# EAGLE design x2-feed (EAGLE 8.2.0)
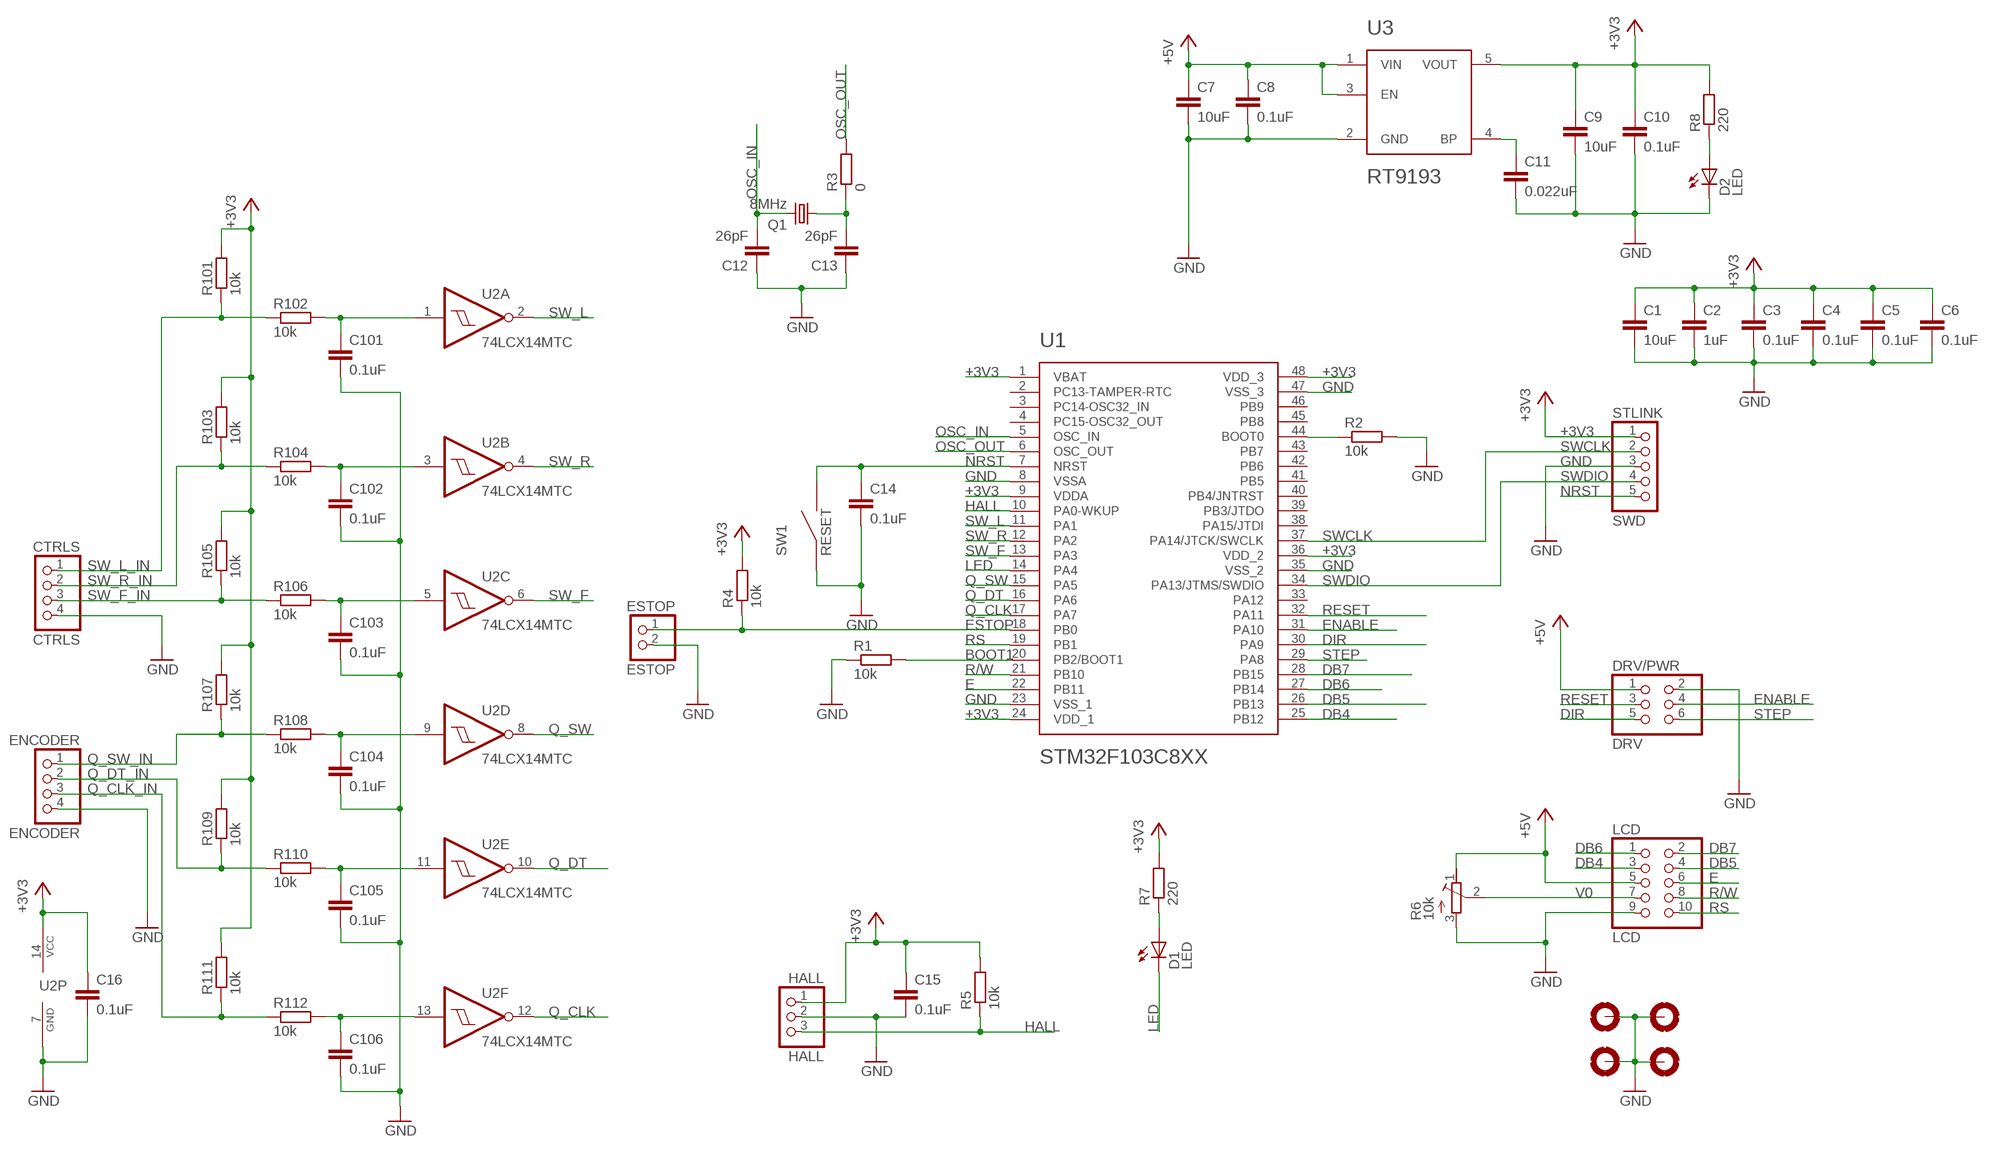
[diagram p0: schematic, sheet 1]

## Parts
C1  10uF  CC2012  [C2012]
C2  1uF  CC1608  [C1608]
C3  0.1uF  CC1608  [C1608]
C4  0.1uF  CC1608  [C1608]
C5  0.1uF  CC1608  [C1608]
C6  0.1uF  CC1608  [C1608]
C7  10uF  CC2012  [C2012]
C8  0.1uF  CC1608  [C1608]
C9  10uF  CC2012  [C2012]
C10  0.1uF  CC1608  [C1608]
C11  0.022uF  CC1608  [C1608]
C12  26pF  CC1608  [C1608]
C13  26pF  CC1608  [C1608]
C14  0.1uF  CC1608  [C1608]
C15  0.1uF  CC1608  [C1608]
C16  0.1uF  CC1608  [C1608]
C101  0.1uF  CC1608  [C1608]
C102  0.1uF  CC1608  [C1608]
C103  0.1uF  CC1608  [C1608]
C104  0.1uF  CC1608  [C1608]
C105  0.1uF  CC1608  [C1608]
C106  0.1uF  CC1608  [C1608]
CTRLS  CTRLS  PINHD-1X4  [1X04]
D1  LED  [LED2012]
D2  LED  [LED2012]
DRV/PWR  DRV  PINHD-2X3  [2X03]
ENCODER  ENCODER  PINHD-1X4  [1X04]
ESTOP  ESTOP  PINHD-1X2  [1X02]
H1  MOUNT-PAD-ROUND2.8  [2,8-PAD]
H2  MOUNT-PAD-ROUND2.8  [2,8-PAD]
H3  MOUNT-PAD-ROUND2.8  [2,8-PAD]
H4  MOUNT-PAD-ROUND2.8  [2,8-PAD]
HALL  HALL  5-103361-1  [5-103361-1]
LCD  LCD  PINHD-2X5  [2X05]
Q1  8MHz  CRYSTAL9B  [HC49/S]
R1  10k  RR1608  [R1608]
R2  10k  RR1608  [R1608]
R3  0  RR1608  [R1608]
R4  10k  RR1608  [R1608]
R5  10k  RR1608  [R1608]
R6  10k  R-TRIMMT93YA  [RTRIMT93YA]
R7  220  RR1608  [R1608]
R8  220  RR1608  [R1608]
R101  10k  RR1608  [R1608]
R102  10k  RR1608  [R1608]
R103  10k  RR1608  [R1608]
R104  10k  RR1608  [R1608]
R105  10k  RR1608  [R1608]
R106  10k  RR1608  [R1608]
R107  10k  RR1608  [R1608]
R108  10k  RR1608  [R1608]
R109  10k  RR1608  [R1608]
R110  10k  RR1608  [R1608]
R111  10k  RR1608  [R1608]
R112  10k  RR1608  [R1608]
STLINK  SWD  PINHD-1X5  [1X05]
SW1  RESET  PUSH  [PUSH]
U1  STM32F103C8XX  [LQFP48-7X7MM]
U2  74LCX14MTC  [TSSOP14]
U3  RT9193  [SOT23-5L]

## Nets
+3V3: C1.1 C2.1 C3.1 C4.1 C5.1 C6.1 C9.1 C10.1 C15.1 C16.1 HALL.1 R4.2 R5.2 R7.2 R8.2 R101.2 R103.2 R105.2 R107.2 R109.2 R111.2 STLINK.1 U1.1(VBAT) U1.9(VDDA) U1.24(VDD_1) U1.36(VDD_2) U1.48(VDD_3) U2.14(P:VCC) U3.5(VOUT)
+5V: C7.1 C8.1 DRV/PWR.1 LCD.5 R6.1(E) U3.1(VIN) U3.3(EN)
BOOT0: R2.1 U1.44(BOOT0)
BOOT1: R1.2 U1.20(PB2/BOOT1)
BP: C11.1 U3.4(BP)
DB4: LCD.3 U1.25(PB12)
DB5: LCD.4 U1.26(PB13)
DB6: LCD.1 U1.27(PB14)
DB7: LCD.2 U1.28(PB15)
DIR: DRV/PWR.5 U1.30(PA9)
E: LCD.6 U1.22(PB11)
ENABLE: DRV/PWR.4 U1.31(PA10)
ESTOP: ESTOP.1 R4.1 U1.18(PB0)
GND: C1.2 C2.2 C3.2 C4.2 C5.2 C6.2 C7.2 C8.2 C9.2 C10.2 C11.2 C12.1 C13.1 C14.2 C15.2 C16.2 C101.2 C102.2 C103.2 C104.2 C105.2 C106.2 CTRLS.4 D2.C DRV/PWR.2 ENCODER.4 ESTOP.2 H1.B2,8(MOUNT) H2.B2,8(MOUNT) H3.B2,8(MOUNT) H4.B2,8(MOUNT) HALL.2 LCD.9 R1.1 R2.2 R6.3(A) STLINK.3 SW1.1 SW1.2 U1.8(VSSA) U1.23(VSS_1) U1.35(VSS_2) U1.47(VSS_3) U2.7(P:GND) U3.2(GND)
HALL: HALL.3 R5.1 U1.10(PA0-WKUP)
LED: D1.C U1.14(PA4)
N$1: C13.2 Q1.1 R3.1
N$2: D1.A R7.1
N$3: C101.1 R102.2 U2.1(A:I)
N$4: D2.A R8.1
N$5: C102.1 R104.2 U2.3(B:I)
N$7: C103.1 R106.2 U2.5(C:I)
N$9: C104.1 R108.2 U2.9(D:I)
N$11: C105.1 R110.2 U2.11(E:I)
N$12: C106.1 R112.2 U2.13(F:I)
NRST: C14.1 STLINK.5 SW1.3 SW1.4 U1.7(NRST)
OSC_IN: C12.2 Q1.2 U1.5(OSC_IN)
OSC_OUT: R3.2 U1.6(OSC_OUT)
Q_CLK: U1.17(PA7) U2.12(F:O)
Q_CLK_IN: ENCODER.3 R111.1 R112.1
Q_DT: U1.16(PA6) U2.10(E:O)
Q_DT_IN: ENCODER.2 R109.1 R110.1
Q_SW: U1.15(PA5) U2.8(D:O)
Q_SW_IN: ENCODER.1 R107.1 R108.1
R/W: LCD.8 U1.21(PB10)
RESET: DRV/PWR.3 U1.32(PA11)
RS: LCD.10 U1.19(PB1)
STEP: DRV/PWR.6 U1.29(PA8)
SW_F: U1.13(PA3) U2.6(C:O)
SW_F_IN: CTRLS.3 R105.1 R106.1
SW_L: U1.11(PA1) U2.2(A:O)
SW_L_IN: CTRLS.1 R101.1 R102.1
SW_R: U1.12(PA2) U2.4(B:O)
SW_R_IN: CTRLS.2 R103.1 R104.1
SWCLK: STLINK.2 U1.37(PA14/JTCK/SWCLK)
SWDIO: STLINK.4 U1.34(PA13/JTMS/SWDIO)
V0: LCD.7 R6.2(S)
Unconnected: U1.2(PC13-TAMPER-RTC) U1.3(PC14-OSC32_IN) U1.4(PC15-OSC32_OUT) U1.33(PA12) U1.38(PA15/JTDI) U1.39(PB3/JTDO) U1.40(PB4/JNTRST) U1.41(PB5) U1.42(PB6) U1.43(PB7) U1.45(PB8) U1.46(PB9)

## Library data of the parts
C1-C16 C101-C106 = x2-feed:C
CTRLS ENCODER = x2-feed:PINHD-1X4: PIN HEADER
D1 D2 = x2-feed:LED
DRV/PWR = x2-feed:PINHD-2X3: PIN HEADER
ESTOP = x2-feed:PINHD-1X2: PIN HEADER
H1-H4 = x2-feed:MOUNT-PAD-ROUND: MOUNTING PAD, round
HALL = x2-feed:5-103361-1: PIN HEADER
LCD = x2-feed:PINHD-2X5: PIN HEADER
Q1 = x2-feed:CRYSTAL
R1-R5 R7 R8 R101-R112 = x2-feed:R
R6 = x2-feed:R-TRIMM: Trimm resistor
STLINK = x2-feed:PINHD-1X5: PIN HEADER
SW1 = x2-feed:PUSH
U1 = x2-feed:STM32F103C8XX
U2 = x2-feed:74LCX14MTC
U3 = x2-feed:RT9193

## Board
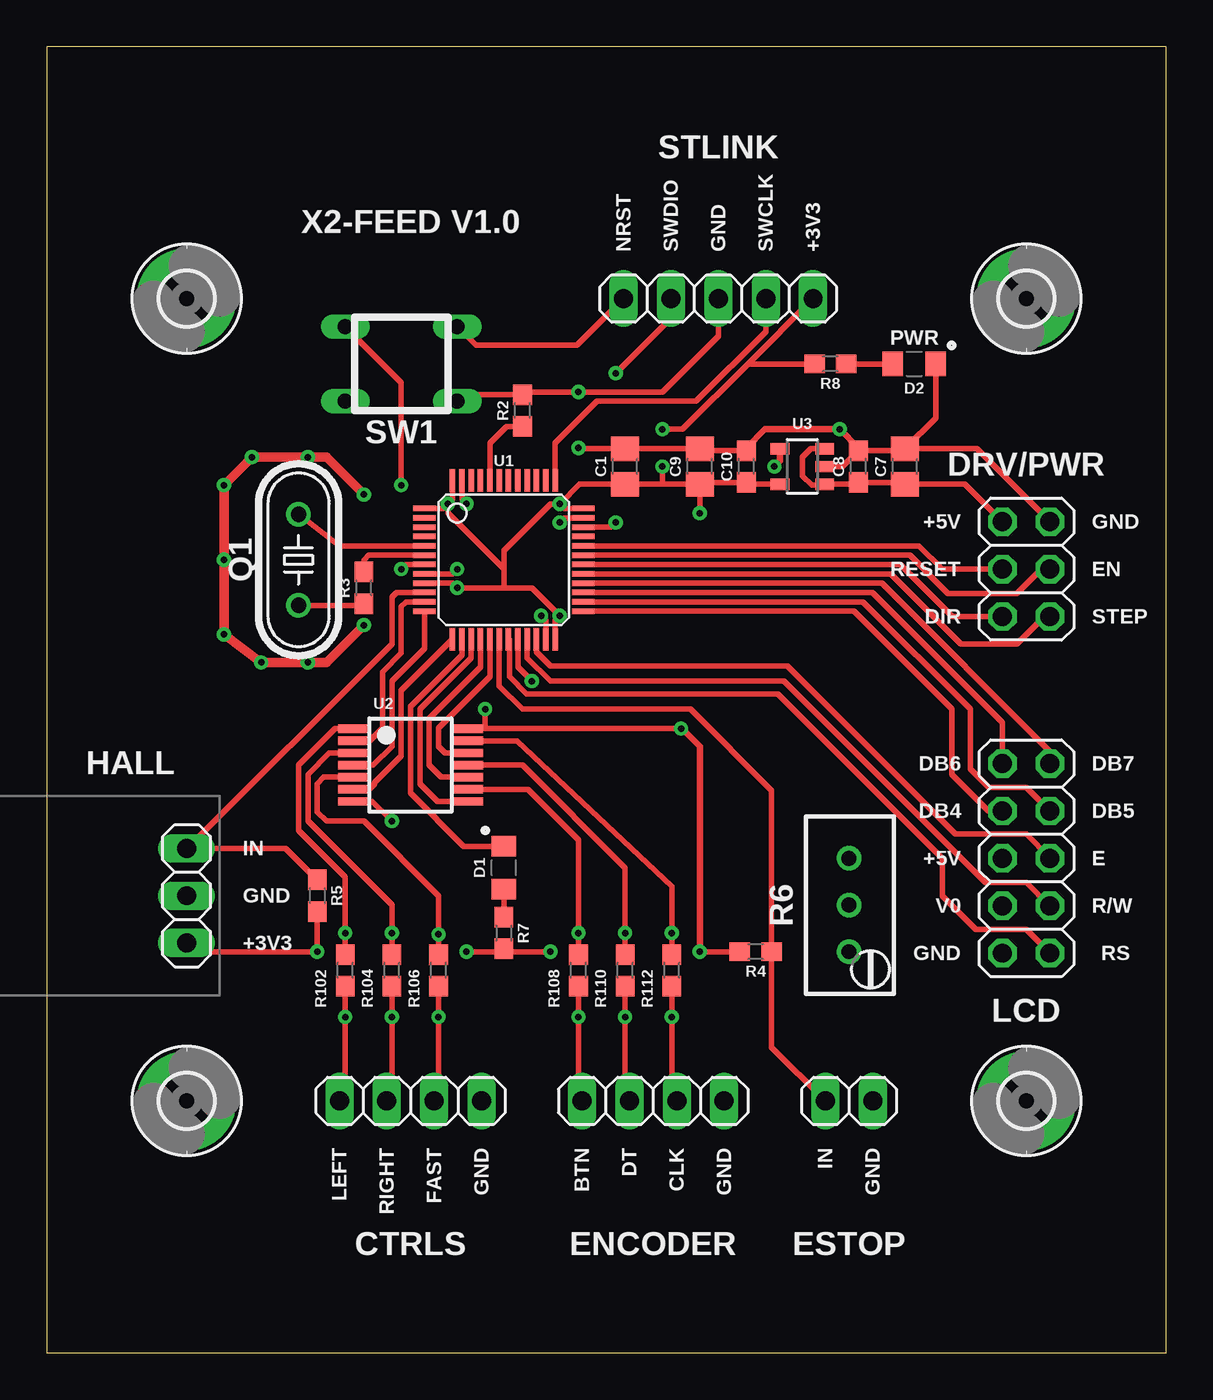
[diagram p1: board, top side]
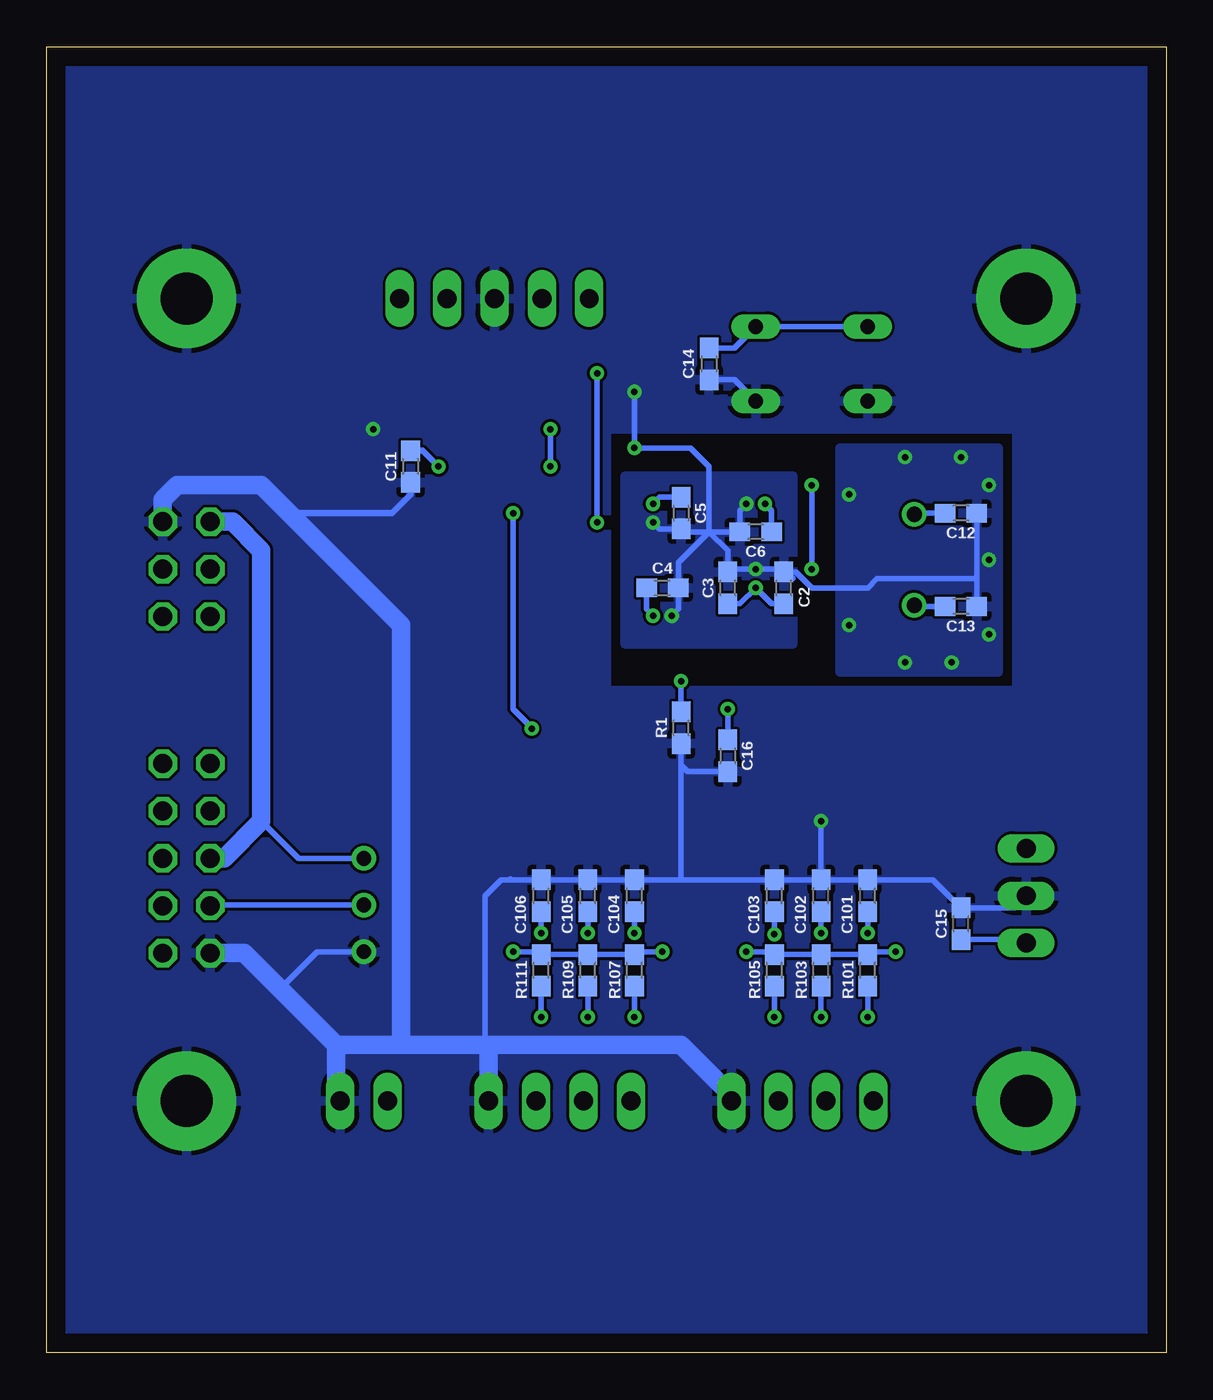
[diagram p2: board, bottom side, seen from below]

Size 60 x 70 mm. Coordinates in mm from the lower left corner, seen from the top.
Outline: 0,0 60,0 60,70 0,70 0,0
Copper layers (1*16): Top 0.035mm / dielectric 1.5mm / Bottom 0.035mm
Design rules "pcbway": minimum track width 0.15mm, minimum drill 0.3mm, track to track 6mil, track to pad 6mil, pad to pad 6mil, via to via 6mil, smd to smd 6mil, copper to edge 40mil, drill to drill 6mil, minimum pad ring 10mil, minimum via ring 8mil, stop-mask expansion 4mil, vias tented up to drill 0mil, thermal gap 10mil

### Footprints (pad centres in the part's own frame; a part is rotated, then mirrored left to right if it is on the bottom)
C2012 = smd 1.3 x 1.5: 1 -0.95,0; 2 0.95,0
C1608 = smd 1.1 x 1: 1 -0.85,0; 2 0.85,0
1X04 = drill 1.016 long: 1 -3.81,0; 2 -1.27,0; 3 1.27,0; 4 3.81,0
LED2012 = smd 1.1 x 1.3: A -1.15,0; C 1.15,0
2X03 = drill 1.016 octagon: 1 -2.54,-1.27; 2 -2.54,1.27; 3 0,-1.27; 4 0,1.27; 5 2.54,-1.27; 6 2.54,1.27
1X02 = drill 1.016 long: 1 -1.27,0; 2 1.27,0
2,8-PAD = drill 2.8 pad 5.334: B2,8 0,0
5-103361-1 = drill 1.016 long: 1 -2.54,0; 2 0,0; 3 2.54,0
2X05 = drill 1.016 octagon: 1 -5.08,-1.27; 2 -5.08,1.27; 3 -2.54,-1.27; 4 -2.54,1.27; 5 0,-1.27; 6 0,1.27; 7 2.54,-1.27; 8 2.54,1.27; 9 5.08,-1.27; 10 5.08,1.27
HC49/S = drill 0.813: 1 -2.44,0; 2 2.44,0
R1608 = smd 1.1 x 1: 1 -0.85,0; 2 0.85,0
RTRIMT93YA = drill 0.8: 1 0,-2.5; 2 0,0; 3 0,2.5
1X05 = drill 1.016 long: 1 -5.08,0; 2 -2.54,0; 3 0,0; 4 2.54,0; 5 5.08,0
PUSH = drill 0.8 long: 1 -3,2; 2 3,2; 3 -3,-2; 4 3,-2
LQFP48-7X7MM = smd 1.2 x 0.3: 1 -4.25,2.75; 2 -4.25,2.25; 3 -4.25,1.75; 4 -4.25,1.25; 5 -4.25,0.75; 6 -4.25,0.25; 7 -4.25,-0.25; 8 -4.25,-0.75; 9 -4.25,-1.25; 10 -4.25,-1.75; 11 -4.25,-2.25; 12 -4.25,-2.75; 25 4.25,-2.75; 26 4.25,-2.25; 27 4.25,-1.75; 28 4.25,-1.25; 29 4.25,-0.75; 30 4.25,-0.25; 31 4.25,0.25; 32 4.25,0.75; 33 4.25,1.25; 34 4.25,1.75; 35 4.25,2.25; 36 4.25,2.75 | smd 0.3 x 1.2: 13 -2.75,-4.25; 14 -2.25,-4.25; 15 -1.75,-4.25; 16 -1.25,-4.25; 17 -0.75,-4.25; 18 -0.25,-4.25; 19 0.25,-4.25; 20 0.75,-4.25; 21 1.25,-4.25; 22 1.75,-4.25; 23 2.25,-4.25; 24 2.75,-4.25; 37 2.75,4.25; 38 2.25,4.25; 39 1.75,4.25; 40 1.25,4.25; 41 0.75,4.25; 42 0.25,4.25; 43 -0.25,4.25; 44 -0.75,4.25; 45 -1.25,4.25; 46 -1.75,4.25; 47 -2.25,4.25; 48 -2.75,4.25
TSSOP14 = smd 0.45 x 1.65: 1 -1.95,-3.05; 2 -1.3,-3.05; 3 -0.65,-3.05; 4 0,-3.05; 5 0.65,-3.05; 6 1.3,-3.05; 7 1.95,-3.05; 8 1.95,3.05; 9 1.3,3.05; 10 0.65,3.05; 11 0,3.05; 12 -0.65,3.05; 13 -1.3,3.05; 14 -1.95,3.05
SOT23-5L = smd 0.6 x 1: 1 -0.95,-1.2; 2 0,-1.2; 3 0.95,-1.2; 4 0.95,1.2; 5 -0.95,1.2

### Placement (x,y rotation side)
C1  31,47.5 90 top
C2  20.5,41 90 bottom
C3  23.5,41 90 bottom
C4  27,41 0 bottom
C5  26,45 270 bottom
C6  22,44 180 bottom
C7  46,47.5 90 top
C8  43.5,47.5 90 top
C9  35,47.5 90 top
C10  37.5,47.5 90 top
C11  40.5,47.5 270 bottom
C12  11,45 180 bottom
C13  11,40 180 bottom
C14  24.5,53 270 bottom
C15  11,23 90 bottom
C16  23.5,32 270 bottom
C101  16,24.5 90 bottom
C102  18.5,24.5 90 bottom
C103  21,24.5 90 bottom
C104  28.5,24.5 90 bottom
C105  31,24.5 90 bottom
C106  33.5,24.5 90 bottom
CTRLS  19.5,13.5 0 top
D1  24.5,26 90 top
D2  46.5,53 0 top
DRV/PWR  52.5,42 270 top
ENCODER  32.5,13.5 0 top
ESTOP  43,13.5 0 top
H1  7.5,13.5 0 top
H2  52.5,13.5 0 top
H3  52.5,56.5 0 top
H4  7.5,56.5 0 top
HALL  7.5,24.5 90 top
LCD  52.5,26.5 270 top
Q1  13.5,42.5 90 top
R1  26,33.5 90 bottom
R2  25.5,50.5 90 top
R3  17,41 90 top
R4  38,21.5 180 top
R5  14.5,24.5 270 top
R6  43,24 180 top
R7  24.5,22.5 270 top
R8  42,53 180 top
R101  16,20.5 90 bottom
R102  16,20.5 90 top
R103  18.5,20.5 90 bottom
R104  18.5,20.5 90 top
R105  21,20.5 90 bottom
R106  21,20.5 90 top
R107  28.5,20.5 90 bottom
R108  28.5,20.5 90 top
R109  31,20.5 90 bottom
R110  31,20.5 90 top
R111  33.5,20.5 90 bottom
R112  33.5,20.5 90 top
STLINK  36,56.5 180 top
SW1  19,53 180 top
U1  24.5,42.5 0 top
U2  19.5,31.5 270 top
U3  40.5,47.5 90 top

### Tracks (layer width: path | path; a pad name or v marks a point on that pad's centre or on a via)
+3V3  (via drill 0.35)
  Top 0.3: U3.5 37.6,46.55 C10.1 35.1,46.65 C9.1 | 34.05,33.45 v34,33.45 23.5,33.45 | 23.5,33.45 U2.14 | U1.36 27.75,45.25 v27.5,45.5 | U1.9 21.75,41.25 v22,41 24.5,41 | U1.48 21.75,45.75 v21.5,45.5 | U1.24 27.25,39.25 v27.5,39.5 26,41 24.5,41 | v21.5,45.5 21.5,45 24.5,42 | v27.5,45.5 27,45.5 24.5,43 24.5,42 | 24.5,42 24.5,41 | v27.5,45.5 28.55,46.55 C1.1 33,46.55 | U1.1 21.25,45.25 v21.5,45.5 | 33,46.55 C9.1 | v33,47.5 33,46.55 | C9.1 v35,45 | v33,49.5 34.08,49.5 37.58,53 | 37.58,53 STLINK.1 | R4.2 v35,21.5 | 23.5,33.45 v23.5,34.5 | HALL.1 7.96,21.5 v14.5,21.5 R5.2 | R8.2 37.58,53 | v22.5,21.5 24.35,21.5 R7.2 24.65,21.5 v27,21.5
  Top 0.35: v35,21.5 35,32.5 34.05,33.45
  Bottom 0.3: 20.25,40.15 C2.1 21.15,40.15 v22,41 22.85,40.15 C3.1 | R111.2 33.5,21.5 | R111.2 R109.2 R107.2 28.35,21.5 v27,21.5 | C4.1 27.85,39.85 v27.5,39.5 | C6.1 21.15,45.15 v21.5,45.5 | C5.1 27.15,45.85 v27.5,45.5 | v35,45 35,34.5 34,33.5 v34,33.45 | C15.1 7.69,22.15 HALL.1 | v33,47.5 v33,49.5 | v22.5,21.5 21.15,21.5 R105.2 R103.2 R101.2 15.85,21.5 v14.5,21.5 | v35,21.5 33.65,21.5 R111.2 | C16.1 v23.5,34.5
+5V
  Top 0.3: U3.3 40.95,48.45 40.5,48 40.5,47 41,46.5 41.65,46.5 U3.1 43.4,46.55 C8.1 45.9,46.65 C7.1 49.22,46.55 DRV/PWR.1
  Bottom 0.3: R6.1 46.5,26.5 48.5,28.5
  Bottom 1: DRV/PWR.1 50.04,44.54 48.5,43 48.5,28.5 50.5,26.5 LCD.5
BOOT0
  Top 0.3: U1.44 23.75,48.75 24.65,49.65 R2.1
BOOT1  (via drill 0.35)
  Top 0.3: U1.20 25.25,36.75 v26,36
  Bottom 0.3: v26,36 R1.2
BP  (via drill 0.35)
  Top 0.35: U3.4 39.3,47.8 v39,47.5
  Bottom 0.35: C11.1 39.85,48.35 v39,47.5
DB4
  Top 0.3: U1.25 43.25,39.75 48.5,34.5 48.5,31 50.46,29.04 LCD.3
DB5
  Top 0.3: LCD.4 52.51,30.3 50.5,30.3 49.5,31.3 49.5,34.5 43.75,40.25 U1.26
DB6
  Top 0.3: U1.27 44.25,40.75 51.23,33.77 LCD.1
DB7
  Top 0.3: LCD.2 53.77,32.23 44.75,41.25 U1.28
DIR
  Top 0.3: U1.30 45.75,42.25 48.54,39.46 DRV/PWR.5
E
  Top 0.3: U1.22 26.25,37.55 27,36.8 39.7,36.8 48.7,27.8 52.5,27.8 53.77,26.53 LCD.6
ENABLE
  Top 0.3: U1.31 46.25,42.75 48.3,40.7 52,40.7 53.3,42 DRV/PWR.4
ESTOP
  Top 0.3: U1.18 24.25,35.75 25.5,34.5 34.5,34.5 38.85,30.15 R4.1 38.85,16.38 ESTOP.1
GND  (via drill 0.35)
  Top 0.3: U3.2 42.65,47.5 C8.2 45.9,48.35 C7.2 | C10.2 35.1,48.35 C9.2 C1.2 28.55,48.45 v28.5,48.5 | C7.2 49.86,48.45 DRV/PWR.2 | U2.7 17.45,29.55 v18.5,28.5 | U1.8 21.75,41.75 v22,42 | U1.47 22.25,45.75 v22.5,45.5 | U1.35 27.75,44.75 v27.5,44.5 | U1.23 26.75,39.25 v26.5,39.5 | STLINK.3 36,54.5 33,51.5 v28.5,51.5 25.65,51.5 R2.2 22.35,51.35 SW1.1 | D2.C 47.65,50.1 C7.2
  Top 0.35: C10.2 37.5,48.5 38.5,49.5 v42.5,49.5 43.5,48.5 C8.2
  Top 0.5: v17,39 15,37 v14,37 v11.5,37 v9.5,38.5 v9.5,42.5 v9.5,46.5 v11,48 v14,48 15,48 v17,46
  Bottom 0.3: C102.2 C101.2 12.5,25.35 C15.2 8.15,23.85 HALL.2 | C102.2 C103.2 26,25.35 | 26,25.35 C104.2 C105.2 C106.2 35.2,25.35 | 35.2,25.35 35.65,25.35 36.5,24.5 36.5,16.5 | C102.2 v18.5,28.5 | 26,31.5 26,25.35 | 26,31.5 R1.1 | C2.2 20.65,42 v22,42 23.35,42 C3.2 23.5,43 24.5,44 | v26.5,39.5 26.15,39.85 C4.2 26.15,42.35 24.5,44 | v22.5,45.5 22.85,45.15 C6.2 24.5,44 | v27.5,44.5 27.15,44.15 C5.2 25.85,44 24.5,44 | 35.15,25.4 35.2,25.35 | 24.5,44 24.5,47.5 25.5,48.5 v28.5,48.5 v28.5,51.5 | C14.2 23.15,52.15 SW1.1 | 10.15,41.5 C13.1 | 10.15,41.5 C12.1 | C2.2 20.35,41.85 20,41.5 | C2.2 19.85,41.85 19,41 16,41 15.5,41.5 10.15,41.5 | C16.2 25.65,31.15 26,31.5 | R6.3 45.5,21.5 47.5,19.5
  Bottom 0.35: C11.2 40.5,46 41.5,45 47,45
  Bottom 1: CTRLS.4 23.31,13.81 26,16.5 36.5,16.5 | ENCODER.4 36.31,16.31 36.5,16.5 | 41,16.5 44.5,16.5 | 41,16.5 36.5,16.5 | 44.5,16.5 44.5,13.73 ESTOP.2 | LCD.9 49.42,21.42 47.5,19.5 44.5,16.5 | DRV/PWR.2 53.77,45.73 53,46.5 48.5,46.5 47,45 41,39 41,16.5
  pour Bottom (rank 3): 0.5,69.5 59.5,69.5 59.5,0.5 0.5,0.5 0.5,35.5 30,35.5 30,49.5 0.5,49.5
  pour Bottom: 0.5,49.5 8,49.5 8,35.5 0.5,35.5
  pour Bottom: 9,48.5 17.5,48.5 17.5,36.5 9,36.5
  pour Bottom: 20,47 29,47 29,38 20,38
HALL
  Top 0.3: U1.10 18.75,40.75 18.5,40.5 18.5,38 7.54,27.04 HALL.3 12.81,27.04 R5.1
LED
  Top 0.3: U1.14 22.25,37.39 19.5,34.64 19.5,30 22.35,27.15 D1.C
N$1
  Top 0.3: Q1.1 16.91,40.06 R3.1
  Bottom 0.3: C13.2 13.44,40 Q1.1
N$2
  Top 0.3: D1.A R7.1
N$3  (via drill 0.35)
  Top 0.3: R102.2 v16,22.5 16,25.5 13.5,28 13.5,31.5 15.45,33.45 U2.1
  Bottom 0.3: C101.1 v16,22.5
N$4
  Top 0.3: R8.1 D2.A
N$5  (via drill 0.35)
  Top 0.3: R104.2 v18.5,22.5 18.5,24 14,28.5 14,31 15.15,32.15 U2.3
  Bottom 0.3: C102.1 v18.5,22.5
N$7  (via drill 0.35)
  Top 0.3: v21,22.43 R106.2 | v21,22.43 21,22.5 | U2.5 14.85,30.85 14.5,30.5 14.5,29 15,28.5 17,28.5 21,24.5 v21,22.43
  Bottom 0.3: C103.1 v21,22.43
N$9  (via drill 0.35)
  Top 0.3: R108.2 v28.5,22.5 28.5,27.5 25.8,30.2 U2.9
  Bottom 0.3: C104.1 v28.5,22.5
N$11  (via drill 0.35)
  Top 0.3: R110.2 v31,22.5 31,26 25.5,31.5 U2.11
  Bottom 0.3: C105.1 v31,22.5
N$12  (via drill 0.35)
  Top 0.3: R112.2 v33.5,22.5 33.5,25 25.2,32.8 U2.13
  Bottom 0.3: C106.1 v33.5,22.5
NRST  (via drill 0.35)
  Top 0.3: SW1.3 23,54 28.42,54 STLINK.5 | U1.7 19.25,42.25 v19,42 | v19,46.5 19,52 SW1.4
  Bottom 0.3: SW1.4 SW1.3 23.15,53.85 C14.1 | v19,42 v19,46.5
OSC_IN
  Top 0.3: U1.5 15.69,43.25 Q1.2
  Bottom 0.3: C12.2 13.44,45 Q1.2
OSC_OUT
  Top 0.3: U1.6 17.25,42.75 17,42.5 R3.2
Q_CLK
  Top 0.3: U2.12 21.35,32.15 21,32.5 21,33.5 23.75,36.25 U1.17
Q_CLK_IN  (via drill 0.35)
  Top 0.3: R111.1 v33.5,18 33.5,13.77 ENCODER.3
  Bottom 0.3: R111.1 v33.5,18
Q_DT
  Top 0.3: U2.10 21.15,30.85 20.5,31.5 20.5,34 23.25,36.75 U1.16
Q_DT_IN  (via drill 0.35)
  Top 0.3: R109.1 v31,18 31,13.73 ENCODER.2
  Bottom 0.3: R109.1 v31,18
Q_SW
  Top 0.3: U2.8 20.95,29.55 20,30.5 20,34.5 22.75,37.25 U1.15
Q_SW_IN  (via drill 0.35)
  Top 0.3: R107.1 v28.5,18 28.5,13.69 ENCODER.1
  Bottom 0.3: R107.1 v28.5,18
R/W
  Top 0.3: U1.21 25.75,37.25 27,36 39.5,36 50.3,25.2 52.5,25.2 53.74,23.96 LCD.8
RESET
  Top 0.3: U1.32 46.75,43.25 48,42 DRV/PWR.3
RS
  Top 0.3: U1.19 24.8,38.2 24.8,36.24 25.72,35.32 39.18,35.32 48,26.5 48,24.5 49.8,22.7 52.5,22.7 LCD.10
STEP
  Top 0.3: U1.29 45.25,41.75 49,38 52,38 53.46,39.46 DRV/PWR.6
SW_F
  Top 0.3: U2.6 17.28,30.2 17.58,30.5 17.58,30.58 19,32 19,35.5 U1.13
SW_F_IN  (via drill 0.35)
  Top 0.3: R105.1 v21,18 21,13.73 CTRLS.3
  Bottom 0.3: R105.1 v21,18
SW_L
  Top 0.3: U2.2 17.3,32.8 18,33.5 18,36.5 19,37.5 19,40 19.25,40.25 U1.11
SW_L_IN  (via drill 0.35)
  Top 0.3: R101.1 v16,18 16,13.81 CTRLS.1
  Bottom 0.3: R101.1 v16,18
SW_R
  Top 0.3: U2.4 17.5,31.5 18.5,32.5 18.5,36 20.25,37.75 U1.12
SW_R_IN  (via drill 0.35)
  Top 0.3: R103.1 v18.5,18 18.5,13.77 CTRLS.2
  Bottom 0.3: R103.1 v18.5,18
SWCLK
  Top 0.3: U1.37 27.25,48.75 29.5,51 34.81,51 38.54,54.73 STLINK.2
SWDIO  (via drill 0.35)
  Top 0.3: U1.34 30.25,44.25 v30.5,44.5 | STLINK.4 33.46,55.46 v30.5,52.5
  Bottom 0.3: v30.5,44.5 v30.5,52.5
V0
  Bottom 0.3: R6.2 51.19,24 LCD.7

### Text on the board
tNames: X2-FEED V1.0 | NRST | SWDIO | GND | SWCLK | +3V3 | PWR | +5V | GND | RESET | EN | DIR | STEP | DB6 | DB7 | DB4 | DB5 | IN | +5V | E | GND | V0 | R/W | +3V3 | GND | RS | LEFT | RIGHT | FAST | GND | BTN | DT | CLK | GND | IN | GND